# EAGLE design GloveBoard (EAGLE 6.5.0)
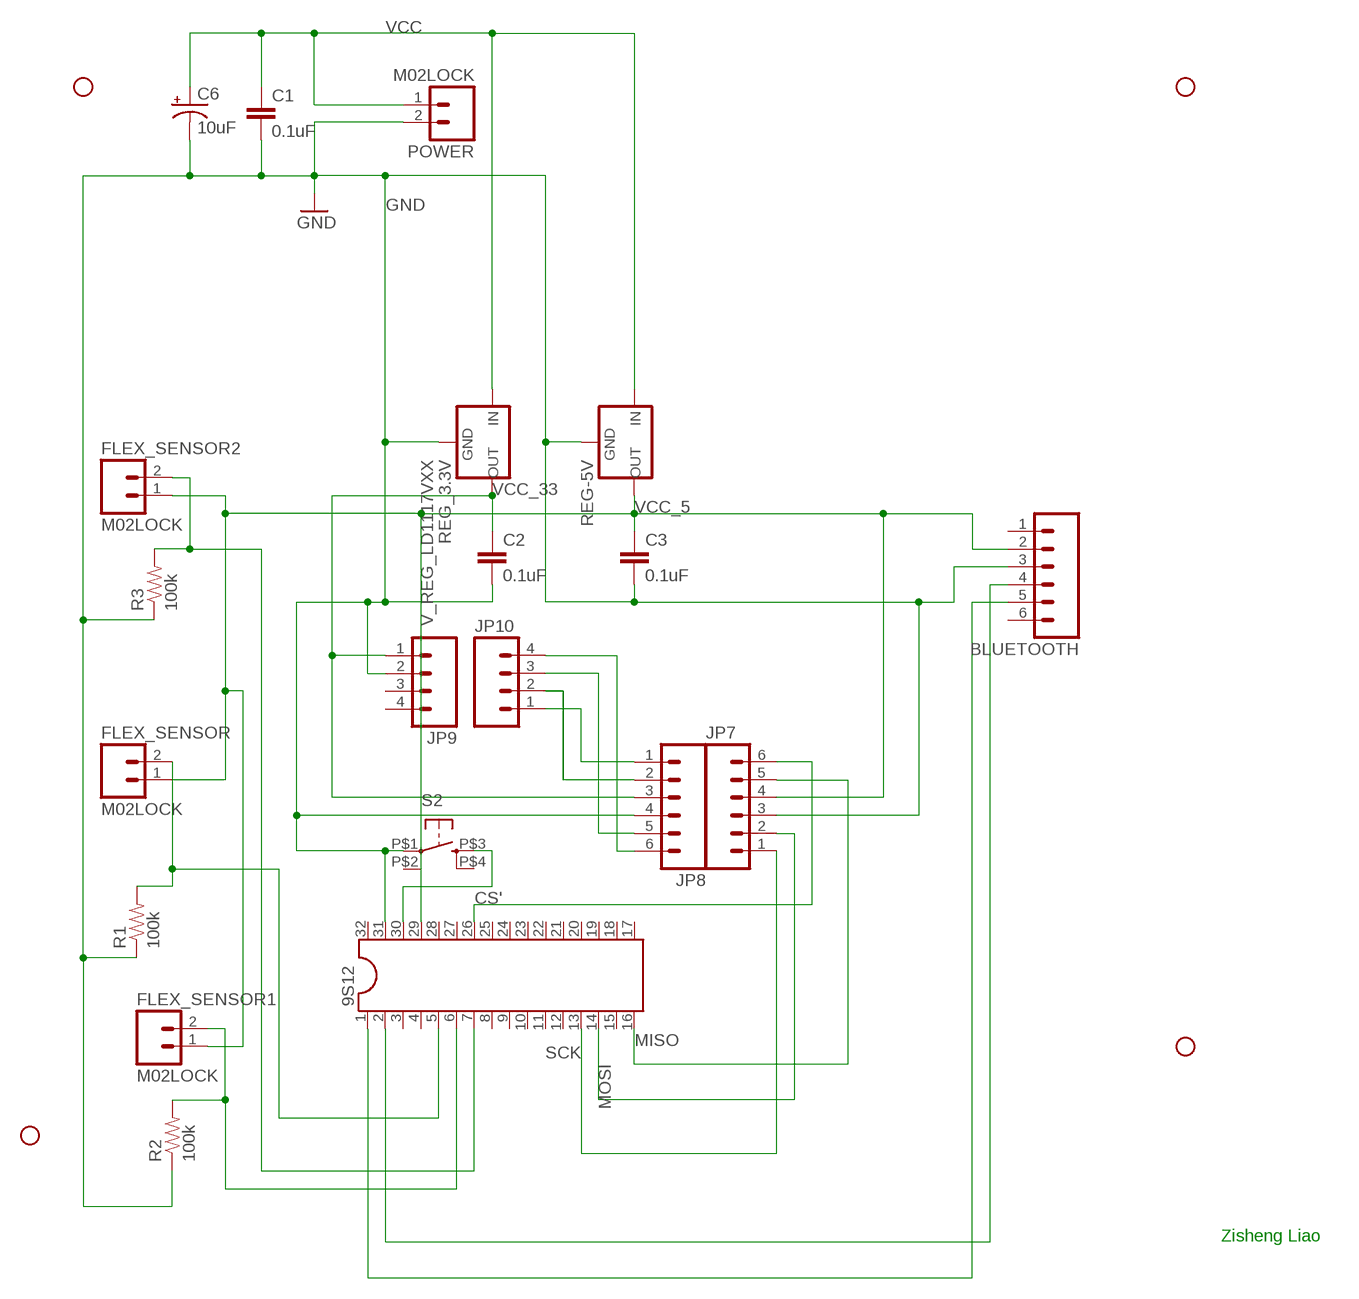
[diagram p0: schematic, sheet 1]

## Parts
9S12  DIL32  [DIL32]
BLUETOOTH  M06LOCK_LONGPADS  [1X06_LOCK_LONGPADS]
C1  0.1uF  0.1UF-50V-20%(PTH)KIT-EZ  [CAP-PTH-SMALL-KIT]
C2  0.1uF  0.1UF-50V-20%(PTH)KIT-EZ  [CAP-PTH-SMALL-KIT]
C3  0.1uF  0.1UF-50V-20%(PTH)KIT-EZ  [CAP-PTH-SMALL-KIT]
C6  10uF  CAP_POLPTH2  [CPOL-RADIAL-10UF-25V]
FLEX_SENSOR  M02LOCK  [1X02_LOCK]
FLEX_SENSOR1  M02LOCK  [1X02_LOCK]
FLEX_SENSOR2  M02LOCK  [1X02_LOCK]
JP7  M06LOCK_LONGPADS  [1X06_LOCK_LONGPADS]
JP8  M06LOCK_LONGPADS  [1X06_LOCK_LONGPADS]
JP9  M04PTH  [1X04]
JP10  M04PTH  [1X04]
POWER  M02LOCK  [1X02_LOCK]
R1  100k  10KOHM1/6W5%(PTH)KIT  [AXIAL-0.3-KIT]
R2  100k  10KOHM1/6W5%(PTH)KIT  [AXIAL-0.3-KIT]
R3  100k  10KOHM1/6W5%(PTH)KIT  [AXIAL-0.3-KIT]
REG-5V  V_REG_78XX-TO-220  [TO-220-ALT]
REG_3.3V  V_REG_LD1117VXX  [78XXL]
S2  TAC_SWITCHKSA_SEALED  [KSA_SEALED_TAC_SWITCH]
STANDOFF1  STAND-OFF  [STAND-OFF]
STANDOFF2  STAND-OFF  [STAND-OFF]
STANDOFF3  STAND-OFF  [STAND-OFF]
STANDOFF4  STAND-OFF  [STAND-OFF]

## Nets
CS': 9S12.26 JP7.6
GND: 9S12.31 BLUETOOTH.3 C1.2 C2.2 C3.2 C6.2(-) JP7.3 JP8.4 JP9.2 POWER.2 R1.P$1 R2.P$1 R3.P$1 REG-5V.GND REG_3.3V.IN(GND) S2.P$1
MISO: 9S12.16 JP7.5
MOSI: 9S12.14 JP7.2
N$1: JP8.2 JP10.2
N$2: JP8.1 JP10.1
N$3: JP8.5 JP10.3
N$4: JP8.6 JP10.4
N$5: 9S12.6 FLEX_SENSOR1.2 R2.P$2
N$6: 9S12.7 FLEX_SENSOR2.2 R3.P$2
N$13: 9S12.30 S2.P$3
N$18: 9S12.1 BLUETOOTH.5
N$19: 9S12.2 BLUETOOTH.4
N$20: 9S12.5 FLEX_SENSOR.2 R1.P$2
SCK: 9S12.13 JP7.1
VCC: C1.1 C6.1(+) POWER.1 REG-5V.IN REG_3.3V.OUT(IN)
VCC_5: 9S12.29 BLUETOOTH.2 C3.1 FLEX_SENSOR1.1 FLEX_SENSOR2.1 FLEX_SENSOR.1 JP7.4 REG-5V.OUT
VCC_33: C2.1 JP8.3 JP9.1 REG_3.3V.GND(OUT)
Unconnected: 9S12.3 9S12.4 9S12.8 9S12.9 9S12.10 9S12.11 9S12.12 9S12.15 9S12.17 9S12.18 9S12.19 9S12.20 9S12.21 9S12.22 9S12.23 9S12.24 9S12.25 9S12.27 9S12.28 9S12.32 BLUETOOTH.1 BLUETOOTH.6 JP9.3 JP9.4 S2.P$2 S2.P$4

## Notes on the sheet
- Zisheng Liao

## Library data of the parts
9S12 = ic-package:DIL32: Dual In Line
BLUETOOTH JP7 JP8 = SparkFun-Connectors:M06: Header 6 Standard 6-pin 0.1" header. Use with straight break away headers (SKU : PRT-00116), right angle break away headers (PRT-00553), swiss pins (PRT-00743), machine pins (PRT-00117), and female headers (PRT-00115). Molex polarized connector foot print use with SKU : PRT-08094 with associated crimp pins and housings. NOTES ON THE VARIANTS LOCK and LOCK_LONGPADS... This footprint was designed to help hold the alignment of a through-hole component (i.e. 6-pin header) while soldering it into place. You may notice that each hole has been shifted either up or down by 0.005 of an inch from it's more standard position (which is a perfectly straight line). This slight alteration caused the pins (the squares in the middle) to touch the edges of the holes. Because they are alternating, it causes a "brace" to hold the component in place. 0.005 has proven to be the perfect amount of "off-center" position when using our standard breakaway headers. Although looks a little odd when you look at the bare footprint, once you have a header in there, the alteration is very hard to notice. Also,if you push a header all the way into place, it is covered up entirely on the bottom side. This idea of altering the position of holes to aid alignment will be further integrated into the Sparkfun Library for other footprints. It can help hold any component with 3 or more connection pins.
C1-C3 = SparkFun-Capacitors:0.1UF-50V-20%(PTH): CAP-08370; PROD_ID: CAP-08370
C6 = SparkFun-Passives:CAP_POL: Capacitor Polarized These are standard SMD and PTH capacitors. Normally 10uF, 47uF, and 100uF in electrolytic and tantalum varieties. Always verify the external diameter of the through hole cap, it varies with capacity, voltage, and manufacturer. The EIA devices should be standard.
FLEX_SENSOR FLEX_SENSOR1 FLEX_SENSOR2 POWER = SparkFun-Connectors:M02: Standard 2-pin 0.1" header. Use with - straight break away headers ( PRT-00116) - right angle break away headers (PRT-00553) - swiss pins (PRT-00743) - machine pins (PRT-00117) - female headers (PRT-00115) Molex polarized connector foot print use with: PRT-08233 with associated crimp pins and housings. 2.54_SCREWTERM for use with PRT-10571. 3.5mm Screw Terminal footprints for PRT-08084 5mm Screw Terminal footprints for use with PRT-08433
JP9 JP10 = SparkFun-Connectors:M04: Header 4 Standard 4-pin 0.1" header. Use with straight break away headers (SKU : PRT-00116), right angle break away headers (PRT-00553), swiss pins (PRT-00743), machine pins (PRT-00117), and female headers (PRT-00115). Molex polarized connector foot print use with SKU : PRT-08231 with associated crimp pins and housings. 1MM SMD Version SKU: PRT-10208
R1-R3 = SparkFun-Resistors:10KOHM1/6W5%(PTH): RES-08375; PROD_ID: RES-08375
REG-5V = SparkFun-PowerIC:V_REG_78XX: Voltage Regulator Standard 7805 5V regulator. IGO (Input Ground Output). Spark Fun Electronics SKU : COM-00107
REG_3.3V = SparkFun-PowerIC:V_REG_LD1117VXX: LD1117VXX voltage regulator. We carry the 3.3V version (COM-00526) in TO-220 package.
S2 = SparkFun-Electromechanical:TAC_SWITCH: Momentary Switch Button commonly used for reset or general input. Spark Fun Electronics SKU : COM-00097 SMT- SWCH-08247
STANDOFF1-STANDOFF4 = SparkFun-Electromechanical:STAND-OFF: #4 Stand Off This is the mechanical footprint for a #4 phillips button head screw. Use the keepout ring to avoid running the screw head into surrounding components. SKU : PRT-00447

## Board
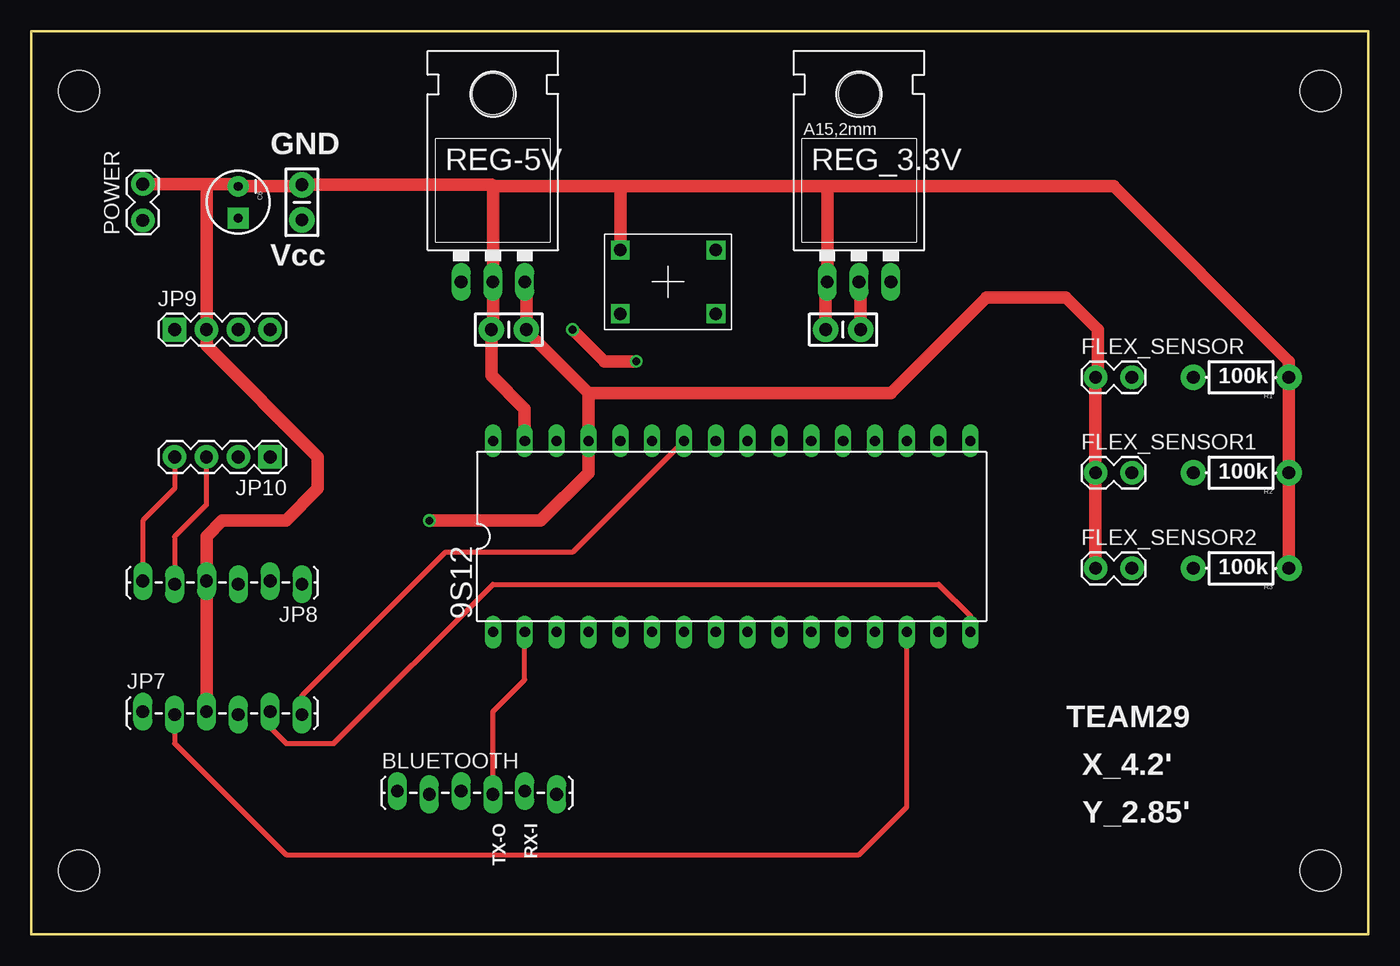
[diagram p1: board, top side]
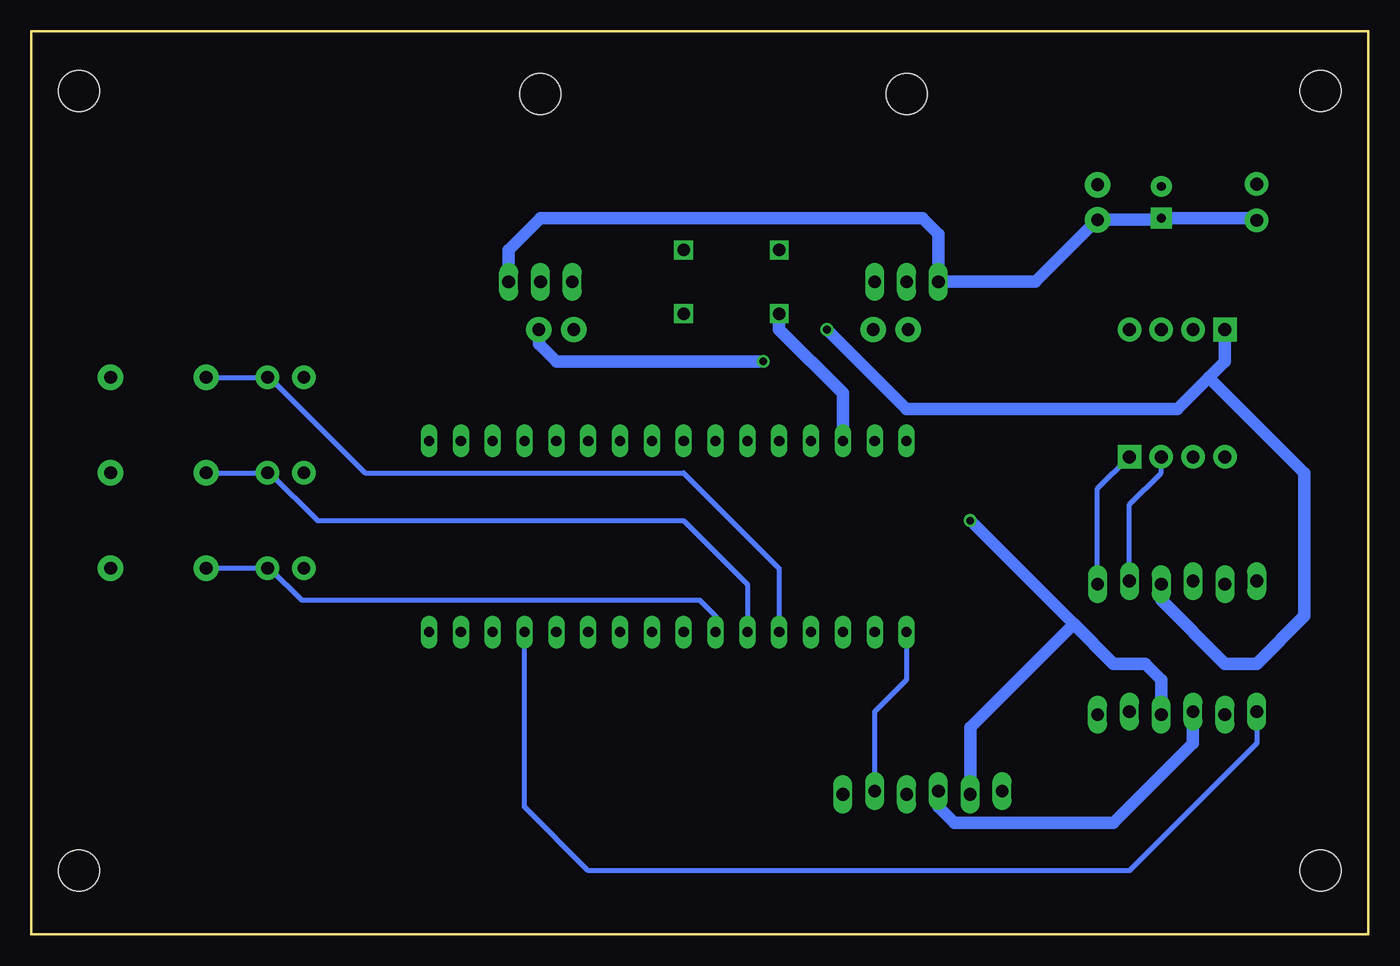
[diagram p2: board, bottom side, seen from below]

Size 106.66 x 72.06 mm. Coordinates in mm from the lower left corner, seen from the top.
Outline: 0,0 106.66,0 106.66,72.06 0,72.06 0,0
Copper layers (1*16): Top 0.035mm / dielectric 1.5mm / Bottom 0.035mm
Design rules "default *": minimum track width 12mil, minimum drill 24mil, track to track 12mil, track to pad 8mil, pad to pad 8mil, via to via 8mil, smd to smd 8mil, copper to edge 15mil, drill to drill 8mil, minimum pad ring 10mil, minimum via ring 8mil, stop-mask expansion 4mil, vias tented up to drill 0mil, thermal gap 10mil

### Footprints (pad centres in the part's own frame; a part is rotated, then mirrored left to right if it is on the bottom)
DIL32 = drill 0.813 long: 1 -19.05,-7.62; 2 -16.51,-7.62; 3 -13.97,-7.62; 4 -11.43,-7.62; 5 -8.89,-7.62; 6 -6.35,-7.62; 7 -3.81,-7.62; 8 -1.27,-7.62; 9 1.27,-7.62; 10 3.81,-7.62; 11 6.35,-7.62; 12 8.89,-7.62; 13 11.43,-7.62; 14 13.97,-7.62; 15 16.51,-7.62; 16 19.05,-7.62; 17 19.05,7.62; 18 16.51,7.62; 19 13.97,7.62; 20 11.43,7.62; 21 8.89,7.62; 22 6.35,7.62; 23 3.81,7.62; 24 1.27,7.62; 25 -1.27,7.62; 26 -3.81,7.62; 27 -6.35,7.62; 28 -8.89,7.62; 29 -11.43,7.62; 30 -13.97,7.62; 31 -16.51,7.62; 32 -19.05,7.62
1X06_LOCK_LONGPADS = drill 1.016 long: 1 0,0; 2 2.54,-0.254; 3 5.08,0; 4 7.62,-0.254; 5 10.16,0; 6 12.7,-0.254
CAP-PTH-SMALL-KIT = drill 1.016 pad 2.032: 1 -1.397,0; 2 1.397,0
CPOL-RADIAL-10UF-25V = drill 0.7 pad 1.651 square: 1 1.27,0 | drill 0.7 pad 1.651: 2 -1.27,0
1X02_LOCK = drill 1.016 pad 1.88: 1 -0.178,0; 2 2.718,0
1X04 = drill 1.016 pad 1.88 square: 1 0,0 | drill 1.016 pad 1.88: 2 2.54,0; 3 5.08,0; 4 7.62,0
AXIAL-0.3-KIT = drill 1.016 pad 2.032: P$1 -3.81,0; P$2 3.81,0
TO-220-ALT = drill 1.016 long: GND 0,-3.81; IN -2.54,-3.81; OUT 2.54,-3.81 | hole 3.302: 0,11.176
78XXL = drill 1.016 long: GND 0,-3.81; IN -2.54,-3.81; OUT 2.54,-3.81 | hole 3.302: 0,11.176
KSA_SEALED_TAC_SWITCH = drill 1 square: P$1 -3.81,2.54; P$2 3.81,2.54; P$3 -3.81,-2.54; P$4 3.81,-2.54
STAND-OFF = hole 3.302: 0,0

### Placement (x,y rotation side)
9S12  55.88,31.75 0 top
BLUETOOTH  29.21,11.43 0 top
C1  21.59,58.42 90 top
C2  64.77,48.26 180 top
C3  38.1,48.26 180 top
C6  16.51,58.42 270 top
FLEX_SENSOR  85.09,44.45 0 top
FLEX_SENSOR1  85.09,36.83 0 top
FLEX_SENSOR2  85.09,29.21 0 top
JP7  8.89,17.78 0 top
JP8  21.59,27.94 180 top
JP9  11.43,48.26 0 top
JP10  19.05,38.1 180 top
POWER  8.89,57.15 90 top
R1  96.52,44.45 180 top
R2  96.52,36.83 180 top
R3  96.52,29.21 180 top
REG-5V  36.83,55.88 0 top
REG_3.3V  66.04,55.88 0 top
S2  50.8,52.07 0 top
STANDOFF1  102.87,67.31 0 top
STANDOFF2  3.81,67.31 0 top
STANDOFF3  102.87,5.08 0 top
STANDOFF4  3.81,5.08 0 top

### Tracks (layer width: path | path; a pad name or v marks a point on that pad's centre or on a via)
CS'
  Top 0.406: 9S12.26 43.18,30.48 33.02,30.48 21.59,19.05 JP7.6
GND
  Top 1.016: 13.97,59.87 16.33,59.87 C6.2 21.46,59.69 C1.2 36.7,59.82 36.83,59.69 | 13.97,59.87 POWER.2 | C2.2 63.37,51.94 REG_3.3V.IN 63.5,59.69 | 9S12.31 39.37,41.91 36.7,44.58 C3.2 36.83,48.39 REG-5V.GND 36.83,59.69 | 36.83,59.69 46.99,59.69 | 46.99,59.69 S2.P$1 | 46.99,59.69 63.5,59.69 | 63.5,59.69 86.36,59.69 100.33,45.72 R1.P$1 R2.P$1 R3.P$1 | 13.97,59.87 JP9.2 13.97,46.99 22.86,38.1 22.86,35.56 20.32,33.02 15.24,33.02 13.97,31.75 JP8.4 JP7.3
  Bottom 1.016: JP7.3 13.97,15.24 20.32,8.89 33.02,8.89 34.29,10.16 BLUETOOTH.3
MISO
  Top 0.406: 9S12.16 74.93,25.4 72.39,27.94 36.83,27.94 24.13,15.24 20.32,15.24 19.05,16.51 JP7.5
MOSI
  Top 0.406: JP7.2 11.43,15.24 20.32,6.35 66.04,6.35 69.85,10.16 9S12.14
N$1
  Bottom 0.406: JP8.2 19.05,34.29 16.51,36.83 JP10.2
N$2
  Bottom 0.406: JP8.1 21.59,35.56 JP10.1
N$3
  Top 0.406: JP8.5 11.43,31.75 13.97,34.29 JP10.3
N$4
  Top 0.406: JP10.4 11.43,35.56 8.89,33.02 JP8.6
N$5
  Bottom 0.406: R2.P$2 FLEX_SENSOR1.2 87.63,36.83 83.82,33.02 54.61,33.02 49.53,27.94 9S12.6
N$6
  Bottom 0.406: R3.P$2 FLEX_SENSOR2.2 87.63,29.21 85.09,26.67 53.34,26.67 52.07,25.4 9S12.7
N$13
  Bottom 1.016: S2.P$3 46.99,48.26 41.91,43.18 9S12.30
N$18
  Bottom 0.406: BLUETOOTH.5 39.37,17.78 36.83,20.32 9S12.1
N$19
  Top 0.406: BLUETOOTH.4 36.83,17.78 39.37,20.32 9S12.2
N$20
  Bottom 0.406: R1.P$2 FLEX_SENSOR.2 87.63,44.45 80.01,36.83 54.61,36.83 46.99,29.21 9S12.5
SCK
  Bottom 0.406: JP7.1 8.89,15.24 19.05,5.08 62.23,5.08 67.31,10.16 9S12.13
VCC
  Bottom 1.016: POWER.1 9.07,57.15 C6.1 16.64,57.02 C1.1 26.54,52.07 REG-5V.IN 34.29,55.88 35.56,57.15 66.04,57.15 68.58,54.61 REG_3.3V.OUT
VCC_5  (via drill 0.61)
  Top 1.016: C3.1 39.5,48.13 44.45,43.18 | 44.45,43.18 9S12.29 44.45,36.83 40.64,33.02 v31.75,33.02 | 39.37,48.39 C3.1 | REG-5V.OUT 39.5,52.07 C3.1 | 44.45,43.18 68.58,43.18 76.2,50.8 82.55,50.8 85.09,48.26 85.09,44.63 FLEX_SENSOR.1 FLEX_SENSOR1.1 FLEX_SENSOR2.1
  Bottom 1.016: v31.75,33.02 23.5,24.77 | 23.5,24.77 20.32,21.59 17.78,21.59 16.51,20.32 JP7.4 | BLUETOOTH.2 31.75,16.51 23.5,24.77
VCC_33  (via drill 0.61)
  Top 1.016: C2.1 66.17,51.94 REG_3.3V.GND | v48.26,45.72 45.72,45.72 v43.18,48.26
  Bottom 1.016: C2.1 66.17,47.12 64.77,45.72 v48.26,45.72 | v43.18,48.26 36.83,41.91 15.24,41.91 12.7,44.45 | JP9.1 11.43,45.72 12.7,44.45 | JP8.3 16.51,26.67 11.43,21.59 8.89,21.59 5.08,25.4 5.08,36.83 12.7,44.45

### Text on the board
tPlace: GND | Vcc | TEAM29 | X_4.2' | TX-O | RX-I | Y_2.85'